# Altium schematic sheet TOP.SchDoc
size A4
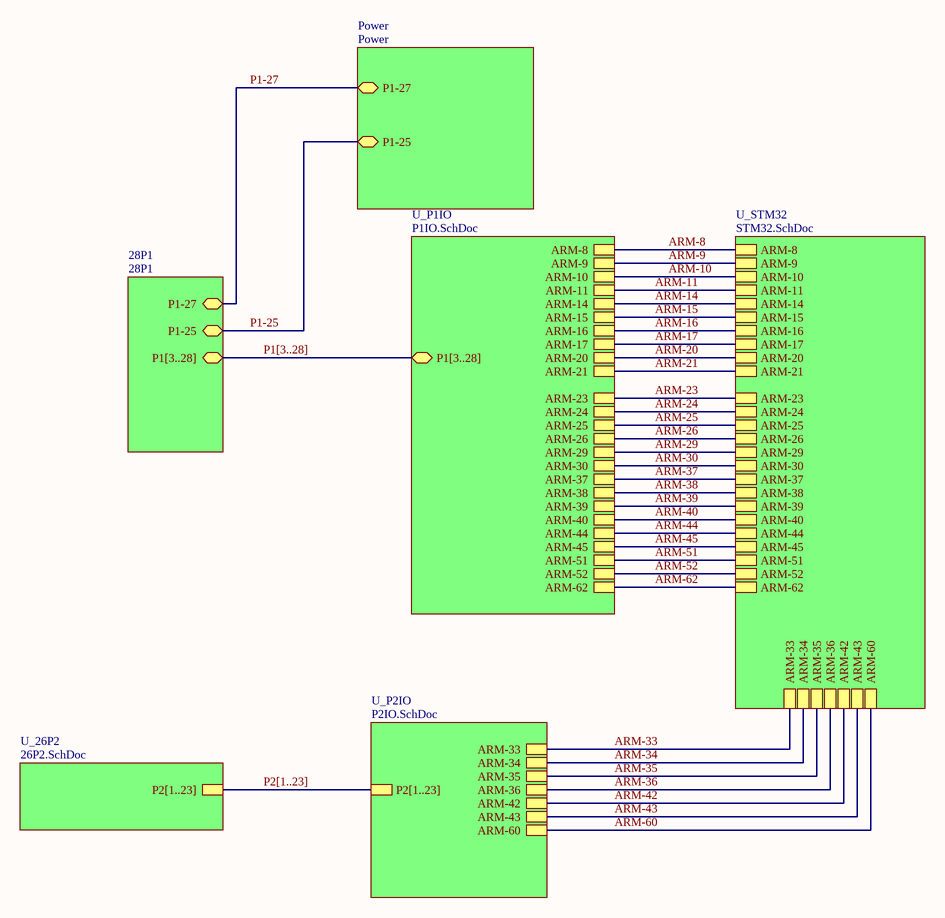
[diagram p0: TOP.SchDoc]

## Sub-sheets
28P1 = 28P1: P1[3..28], P1-27, P1-25
Power = Power: P1-27, P1-25
U_26P2 = 26P2.SchDoc: P2[1..23]
U_P1IO = P1IO.SchDoc: P1[3..28], ARM-37, ARM-38, ARM-39, ARM-40, ARM-51, ARM-52, ARM-9, ARM-10, ARM-11, ARM-23, ARM-24, ARM-29, ARM-30, ARM-44, ARM-45, ARM-62, ARM-14, ARM-15, ARM-16, ARM-17, ARM-20, ARM-21, ARM-25, ARM-26, ARM-8
U_P2IO = P2IO.SchDoc: ARM-36, ARM-34, ARM-33, ARM-60, P2[1..23], ARM-35, ARM-42, ARM-43
U_STM32 = STM32.SchDoc: ARM-26, ARM-29, ARM-30, ARM-33, ARM-34, ARM-35, ARM-36, ARM-37, ARM-38, ARM-39, ARM-40, ARM-52, ARM-60, ARM-62, ARM-42, ARM-43, ARM-44, ARM-45, ARM-51, ARM-20, ARM-21, ARM-23, ARM-24, ARM-25, ARM-8, ARM-9, ARM-10, ARM-11, ARM-14, ARM-15, ARM-16, ARM-17

## Nets
ARM-8: sheet U_STM32/ARM-8, sheet U_P1IO/ARM-8
ARM-9: sheet U_STM32/ARM-9, sheet U_P1IO/ARM-9
ARM-10: sheet U_STM32/ARM-10, sheet U_P1IO/ARM-10
ARM-11: sheet U_STM32/ARM-11, sheet U_P1IO/ARM-11
ARM-14: sheet U_STM32/ARM-14, sheet U_P1IO/ARM-14
ARM-15: sheet U_STM32/ARM-15, sheet U_P1IO/ARM-15
ARM-16: sheet U_STM32/ARM-16, sheet U_P1IO/ARM-16
ARM-17: sheet U_STM32/ARM-17, sheet U_P1IO/ARM-17
ARM-20: sheet U_STM32/ARM-20, sheet U_P1IO/ARM-20
ARM-21: sheet U_STM32/ARM-21, sheet U_P1IO/ARM-21
ARM-23: sheet U_STM32/ARM-23, sheet U_P1IO/ARM-23
ARM-24: sheet U_STM32/ARM-24, sheet U_P1IO/ARM-24
ARM-25: sheet U_STM32/ARM-25, sheet U_P1IO/ARM-25
ARM-26: sheet U_STM32/ARM-26, sheet U_P1IO/ARM-26
ARM-29: sheet U_STM32/ARM-29, sheet U_P1IO/ARM-29
ARM-30: sheet U_STM32/ARM-30, sheet U_P1IO/ARM-30
ARM-33: sheet U_STM32/ARM-33, sheet U_P2IO/ARM-33
ARM-34: sheet U_STM32/ARM-34, sheet U_P2IO/ARM-34
ARM-35: sheet U_STM32/ARM-35, sheet U_P2IO/ARM-35
ARM-36: sheet U_STM32/ARM-36, sheet U_P2IO/ARM-36
ARM-37: sheet U_STM32/ARM-37, sheet U_P1IO/ARM-37
ARM-38: sheet U_STM32/ARM-38, sheet U_P1IO/ARM-38
ARM-39: sheet U_STM32/ARM-39, sheet U_P1IO/ARM-39
ARM-40: sheet U_STM32/ARM-40, sheet U_P1IO/ARM-40
ARM-42: sheet U_STM32/ARM-42, sheet U_P2IO/ARM-42
ARM-43: sheet U_STM32/ARM-43, sheet U_P2IO/ARM-43
ARM-44: sheet U_STM32/ARM-44, sheet U_P1IO/ARM-44
ARM-45: sheet U_STM32/ARM-45, sheet U_P1IO/ARM-45
ARM-51: sheet U_STM32/ARM-51, sheet U_P1IO/ARM-51
ARM-52: sheet U_STM32/ARM-52, sheet U_P1IO/ARM-52
ARM-60: sheet U_STM32/ARM-60, sheet U_P2IO/ARM-60
ARM-62: sheet U_STM32/ARM-62, sheet U_P1IO/ARM-62
P1-25: sheet Power/P1-25, sheet 28P1/P1-25
P1-27: sheet Power/P1-27, sheet 28P1/P1-27

## Buses and harness runs
bus P1[3..28] = sheet 28P1/P1[3..28] = sheet U_P1IO/P1[3..28]
bus P2[1..23] = sheet U_26P2/P2[1..23] = sheet U_P2IO/P2[1..23]